# EAGLE design sdr_3157 (EAGLE 9.6.2)
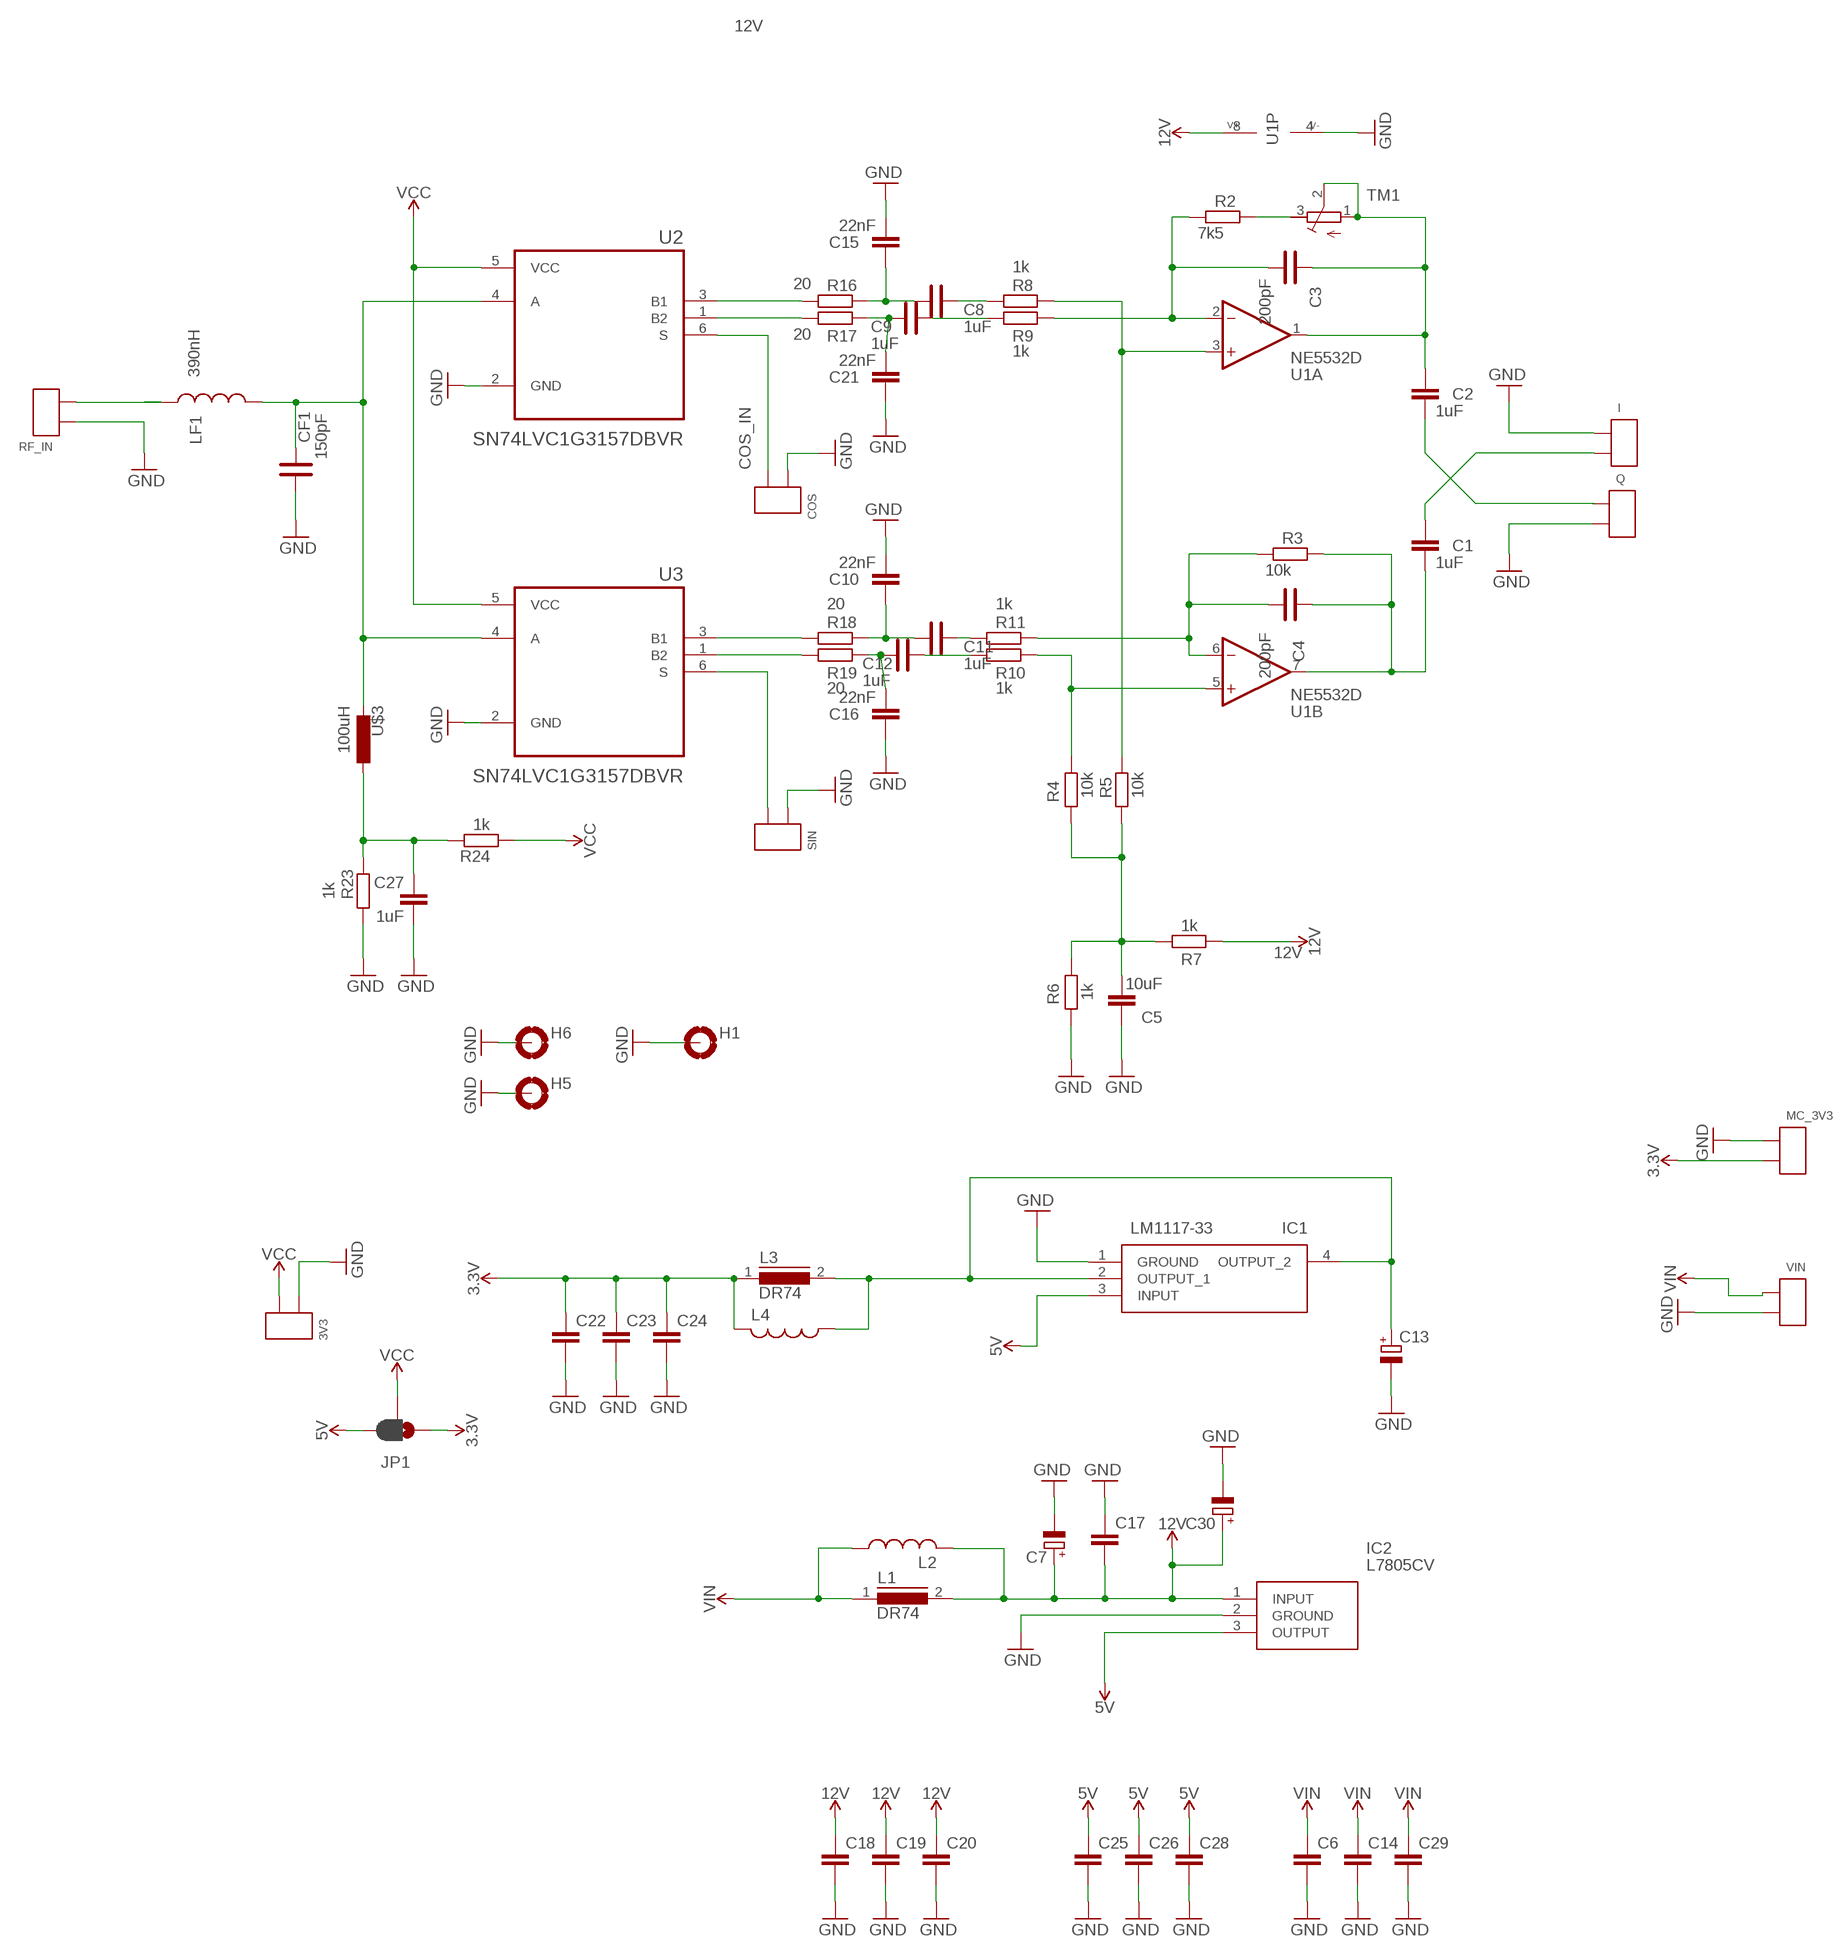
[diagram p0: schematic, sheet 1]

## Parts
3V3  2X_SMD_PTH_PIN  [2X_SMD_PTH]
C1  1uF  C-EU050-045X075  [C050-045X075]
C2  1uF  C-EU050-045X075  [C050-045X075]
C3  200pF  C_0805_PTH  [C0805K]
C4  200pF  C_0805_PTH  [C0805K]
C5  10uF  C_0805_SMD  [C0805]
C6  C_0805_SMD  [C0805]
C7  C_POL  [E5-5]
C8  1uF  C_0805_PTH  [C0805K]
C9  1uF  C_0805_PTH  [C0805K]
C10  22nF  C_0805_SMD  [C0805]
C11  1uF  C_0805_PTH  [C0805K]
C12  1uF  C_0805_PTH  [C0805K]
C13  C_POL  [E5-5]
C14  C_0805_SMD  [C0805]
C15  22nF  C_0805_SMD  [C0805]
C16  22nF  C_0805_SMD  [C0805]
C17  C_0805_SMD  [C0805]
C18  C_0805_SMD  [C0805]
C19  C_0805_SMD  [C0805]
C20  C_0805_SMD  [C0805]
C21  22nF  C_0805_SMD  [C0805]
C22  C_0805_SMD  [C0805]
C23  C_0805_SMD  [C0805]
C24  C_0805_SMD  [C0805]
C25  C_0805_SMD  [C0805]
C26  C_0805_SMD  [C0805]
C27  1uF  C_0805_SMD  [C0805]
C28  C_0805_SMD  [C0805]
C29  C_0805_SMD  [C0805]
C30  C_POL  [E5-5]
CF1  150pF  C_0805_PTH  [C0805K]
COS  2X_SMD_PTH_PIN  [2X_SMD_PTH]
H1  MOUNT-PAD-ROUND3.0  [3,0-PAD]
H5  MOUNT-PAD-ROUND3.0  [3,0-PAD]
H6  MOUNT-PAD-ROUND3.0  [3,0-PAD]
I  2X_SMD_PTH_PIN  [2X_SMD_PTH]
IC1  LM1117-33  LM1117MPX-33NOPB  [SOT230P700X180-4N]
IC2  L7805CV  [TO255P460X1020X2008-3P]
JP1  JUMPER-SMT_3_1-NC_PASTE_NO-SILK  [SMT-JUMPER_3_1-NC_PASTE_NO-SILK]
L1  DR74  [DR74]
L2  L_0805_PTH  [M0805]
L3  DR74  [DR74]
L4  L_0805_PTH  [M0805]
LF1  390nH  L_0805_PTH  [M0805]
MC_3V3  2X_SMD_PTH_PIN  [2X_SMD_PTH]
Q  2X_SMD_PTH_PIN  [2X_SMD_PTH]
R2  7k5  R_0805_SMD  [R0805W]
R3  10k  R_0805_SMD  [R0805W]
R4  10k  R_0805_SMD  [R0805W]
R5  10k  R_0805_SMD  [R0805W]
R6  1k  R_0805_SMD  [R0805W]
R7  1k  R_0805_SMD  [R0805W]
R8  1k  R_0805_SMD  [R0805W]
R9  1k  R_0805_SMD  [R0805W]
R10  1k  R_0805_SMD  [R0805W]
R11  1k  R_0805_SMD  [R0805W]
R16  20  R_0805_SMD  [R0805W]
R17  20  R_0805_SMD  [R0805W]
R18  20  R_0805_SMD  [R0805W]
R19  20  R_0805_SMD  [R0805W]
R23  1k  R_0805_SMD  [R0805W]
R24  1k  R_0805_SMD  [R0805W]
RF_IN  2X_SMD_PTH_PIN  [2X_SMD_PTH]
SIN  2X_SMD_PTH_PIN  [2X_SMD_PTH]
TM1  5k  R-TRIMM3296W  [RTRIM3296W]
U1  NE5532D  [SO08]
U2  SN74LVC1G3157DBVR  [SOT95P280X145-6N]
U3  SN74LVC1G3157DBVR  [SOT95P280X145-6N]
U$3  100uH  L-EU0207/10  [0207/10]
VIN  2X_SMD_PTH_PIN  [2X_SMD_PTH]

## Nets
3.3V: C22.1 C23.1 C24.1 JP1.1 L3.1 L4.2 L4.P$2 MC_3V3.P$2(PIN1) MC_3V3.T$2(PIN1)
5V: C25.1 C26.1 C28.1 IC1.3(INPUT) IC2.3(OUTPUT) JP1.3
12V: C7.+ C17.2 C18.1 C19.1 C20.1 C30.+ IC2.1(INPUT) L1.2 L2.2 L2.P$2 R7.1 U1.8(P:V+)
ANTENNA: CF1.2 CF1.P$2 LF1.2 LF1.P$2 U2.4(A) U3.4(A) U$3.2
COS_IN: COS.P$2(PIN1) COS.T$2(PIN1) U2.6(S)
GND: 3V3.P$1(PIN0) 3V3.T$1(PIN0) C5.1 C6.2 C7.- C10.2 C13.- C14.2 C15.2 C16.1 C17.1 C18.2 C19.2 C20.2 C21.1 C22.2 C23.2 C24.2 C25.2 C26.2 C27.1 C28.2 C29.2 C30.- CF1.1 CF1.P$1 COS.P$1(PIN0) COS.T$1(PIN0) H1.B3,0(MOUNT) H5.B3,0(MOUNT) H6.B3,0(MOUNT) I.P$1(PIN0) I.T$1(PIN0) IC1.1(GROUND) IC2.2(GROUND) MC_3V3.P$1(PIN0) MC_3V3.T$1(PIN0) Q.P$2(PIN1) Q.T$2(PIN1) R6.1 R23.1 RF_IN.P$1(PIN0) RF_IN.T$1(PIN0) SIN.P$1(PIN0) SIN.T$1(PIN0) U1.4(P:V-) U2.2(GND) U3.2(GND) VIN.P$2(PIN1) VIN.T$2(PIN1)
N$1: LF1.1 LF1.P$1 RF_IN.P$2(PIN1) RF_IN.T$2(PIN1)
N$3: R16.1 U2.3(B1)
N$4: R17.1 U2.1(B2)
N$5: R18.1 U3.3(B1)
N$6: C13.+ IC1.2(OUTPUT_1) IC1.4(OUTPUT_2) L3.2 L4.1 L4.P$1
N$7: R19.1 U3.1(B2)
N$8: C8.1 C8.P$1 C15.1 R16.2
N$9: C9.1 C9.P$1 C21.2 R17.2
N$10: C10.1 C11.1 C11.P$1 R18.2
N$11: C12.1 C12.P$1 C16.2 R19.2
N$12: C8.2 C8.P$2 R8.1
N$13: C9.2 C9.P$2 R9.1
N$14: C11.2 C11.P$2 R11.1
N$15: C12.2 C12.P$2 R10.1
N$16: R5.2 R8.2 U1.3(A:+IN)
N$17: C3.1 C3.P$1 R2.1 R9.2 U1.2(A:-IN)
N$18: R4.2 R10.2 U1.5(B:+IN)
N$19: C4.1 C4.P$1 R3.1 R11.2 U1.6(B:-IN)
N$20: C5.2 R4.1 R5.1 R6.2 R7.2
N$21: C2.1 C3.2 C3.P$2 TM1.1(A) TM1.2(S) U1.1(A:OUT)
N$22: C2.2 Q.P$1(PIN0) Q.T$1(PIN0)
N$23: C1.1 I.P$2(PIN1) I.T$2(PIN1)
N$24: C1.2 C4.2 C4.P$2 R3.2 U1.7(B:OUT)
N$25: C27.2 R23.2 R24.2 U$3.1
N$28: R2.2 TM1.3(E)
SIN_IN: SIN.P$2(PIN1) SIN.T$2(PIN1) U3.6(S)
VCC: 3V3.P$2(PIN1) 3V3.T$2(PIN1) JP1.2 R24.1 U2.5(VCC) U3.5(VCC)
VIN: C6.1 C14.1 C29.1 L1.1 L2.1 L2.P$1 VIN.P$1(PIN0) VIN.T$1(PIN0)

## Library data of the parts
3V3 COS I MC_3V3 Q RF_IN SIN VIN = mylib:2X_SMD_PTH_PIN
C1 C2 = rcl:C-EU: CAPACITOR, European symbol; SPICEPREFIX: C
C3 C4 C8 C9 C11 C12 CF1 = mylib:C_0805_PTH
C5 C6 C10 C14-C29 = mylib:C_0805_SMD
C7 C13 C30 = mylib:C_POL
H1 H5 H6 = holes:MOUNT-PAD-ROUND: MOUNTING PAD, round
IC1 = LM1117MPX-33NOPB:LM1117MPX-33NOPB: LDO Voltage Regulators 800-mA 15-V linear voltage regulator 800-mA 15-V linear voltage regulator Source: Datasheet <https://www.arrow.com/en/products/lm1117mpx-33nopb/on-semiconductor>; ARROW_PART_NUMBER: LM1117MPX-33NOPB; ARROW_PRICE-STOCK: https://www.arrow.com/en/products/lm1117mpx-33nopb/on-semiconductor?region=nac; DESCRIPTION: LDO Voltage Regulators 800-mA 15-V linear voltage regulator 800-mA 15-V linear voltage regulator; HEIGHT: 1.8mm; MANUFACTURER_NAME: onsemi; MANUFACTURER_PART_NUMBER: LM1117MPX-33NOPB; MOUSER_PART_NUMBER: 863-LM1117MPX-33NOPB; MOUSER_PRICE-STOCK: https://www.mouser.co.uk/ProductDetail/onsemi/LM1117MPX-33NOPB?qs=DPoM0jnrROUIbzbQHFmeig%3D%3D
IC2 = L7805CV:L7805CV: Linear voltage regulator,L7805CV 5V 1.5A STMicroelectronics L7805CV, Single Linear Voltage Regulator, 1.5A 5 V, 3-Pin TO-220 Source: Datasheet <http://www.st.com/web/en/resource/technical/document/datasheet/CD00000444.pdf>; ARROW_PART_NUMBER: L7805CV; ARROW_PRICE-STOCK: https://www.arrow.com/en/products/l7805cv/stmicroelectronics?region=europe; DESCRIPTION: Linear voltage regulator,L7805CV 5V 1.5A STMicroelectronics L7805CV, Single Linear Voltage Regulator, 1.5A 5 V, 3-Pin TO-220; HEIGHT: 4.6mm; MANUFACTURER_NAME: STMicroelectronics; MANUFACTURER_PART_NUMBER: L7805CV; MOUSER_PART_NUMBER: 511-L7805CV; MOUSER_PRICE-STOCK: https://www.mouser.co.uk/ProductDetail/STMicroelectronics/L7805CV?qs=9NrABl3fj%2FqplZAHiYUxWg%3D%3D
JP1 = SparkFun-Jumpers:JUMPER-SMT_3_1-NC_PASTE: Normally closed solder jumper (1 of 2 connections) This jumper has an aperture in the stencil to allow solder paste to bridge one of the two connections. One connection is normally closed (NC), while the other is normally open (NO). Wick off the solder to open the connection. Reapply solder to reclose the connection. Apply solder to the other side instead to change the current path.
L1 L3 = inductors:DR74: High Power Density, High Efficiency, Shielded Inductors Source: coiltronics_dr_series.pdf; SPICEPREFIX: L
L2 L4 LF1 = mylib:L_0805_PTH
R2-R11 R16-R19 R23 R24 = mylib:R_0805_SMD
TM1 = rcl:R-TRIMM: Trimm resistor; SPICEMODEL: X; SPICEPREFIXL: POT
U1 = op-amp:NE5532: OP-AMP
U2 U3 = SN74LVC1G3157DBVR:SN74LVC1G3157DBVR: Check prices <https://pricing.snapeda.com/parts/SN74LVC1G3157DBVR/Texas%20Instruments/view-part?ref=eda>; AVAILABILITY: In Stock; DESCRIPTION: 5-V, 2:1 (SPDT), 1-channel general-purpose analog switch 6-SOT-23 -40 to 125; MF: Texas Instruments; MP: SN74LVC1G3157DBVR; PACKAGE: SOT-23-6 Texas Instruments; PRICE: None; PURCHASE-URL: https://pricing.snapeda.com/search/part/SN74LVC1G3157DBVR/?ref=eda
U$3 = rcl:L-EU: INDUCTOR, European symbol; SPICEPREFIX: L

## Board
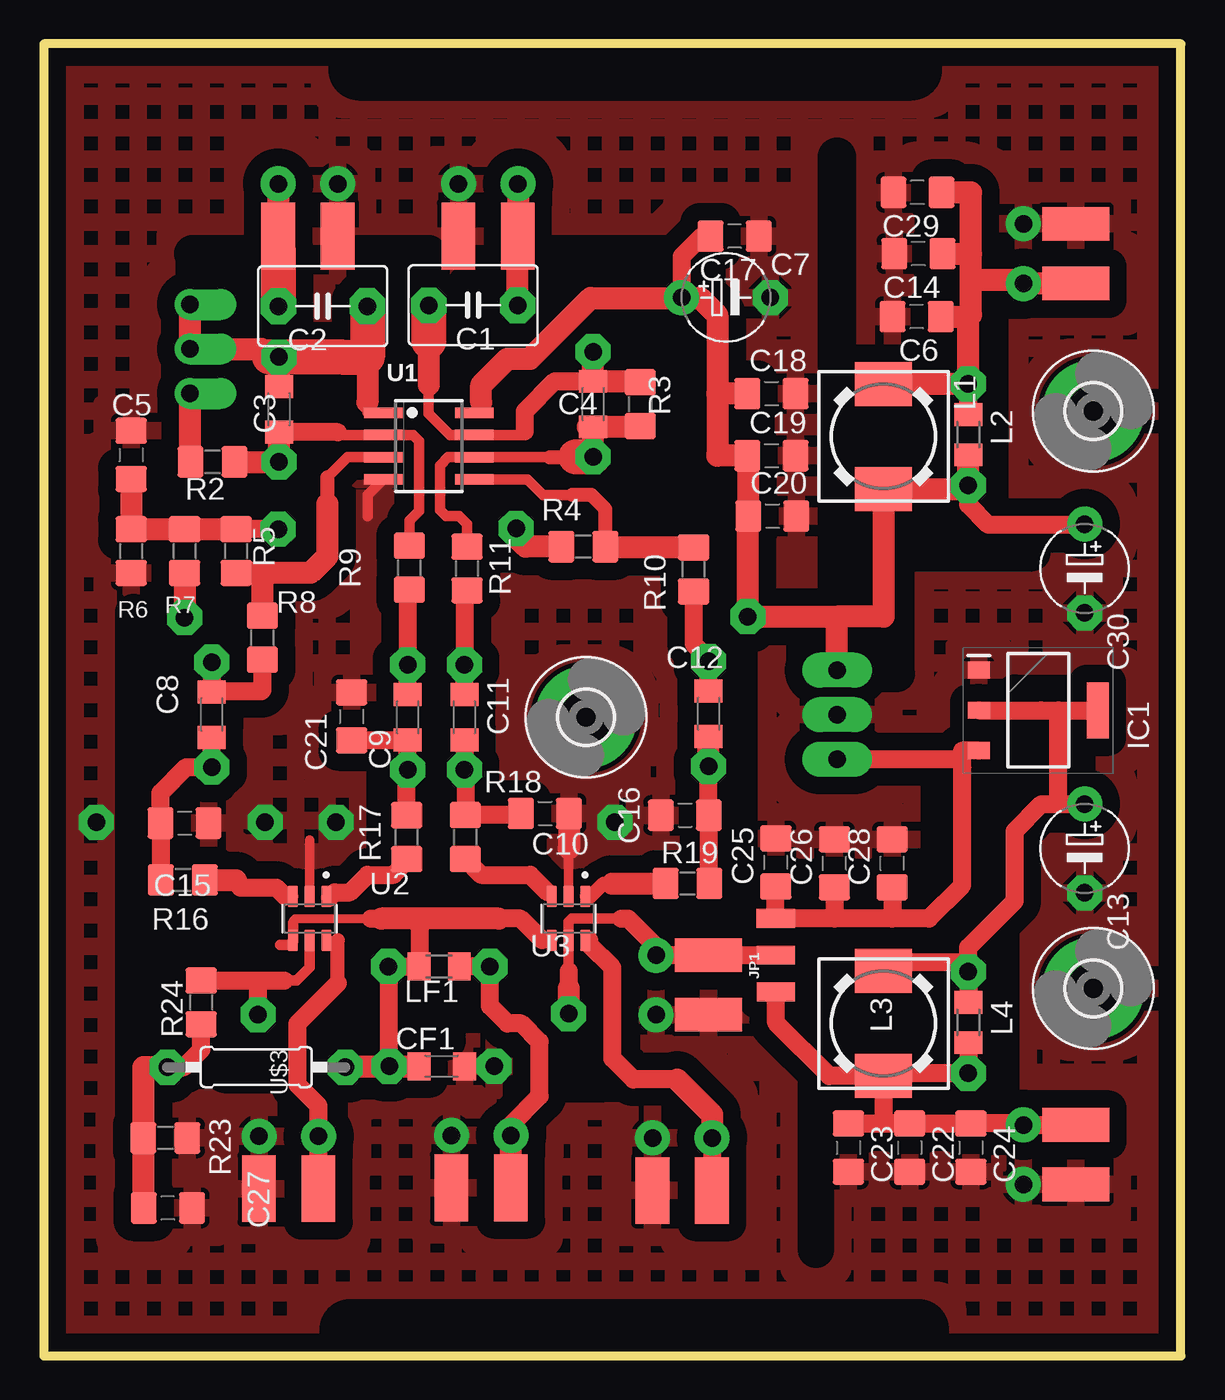
[diagram p1: board, top side]
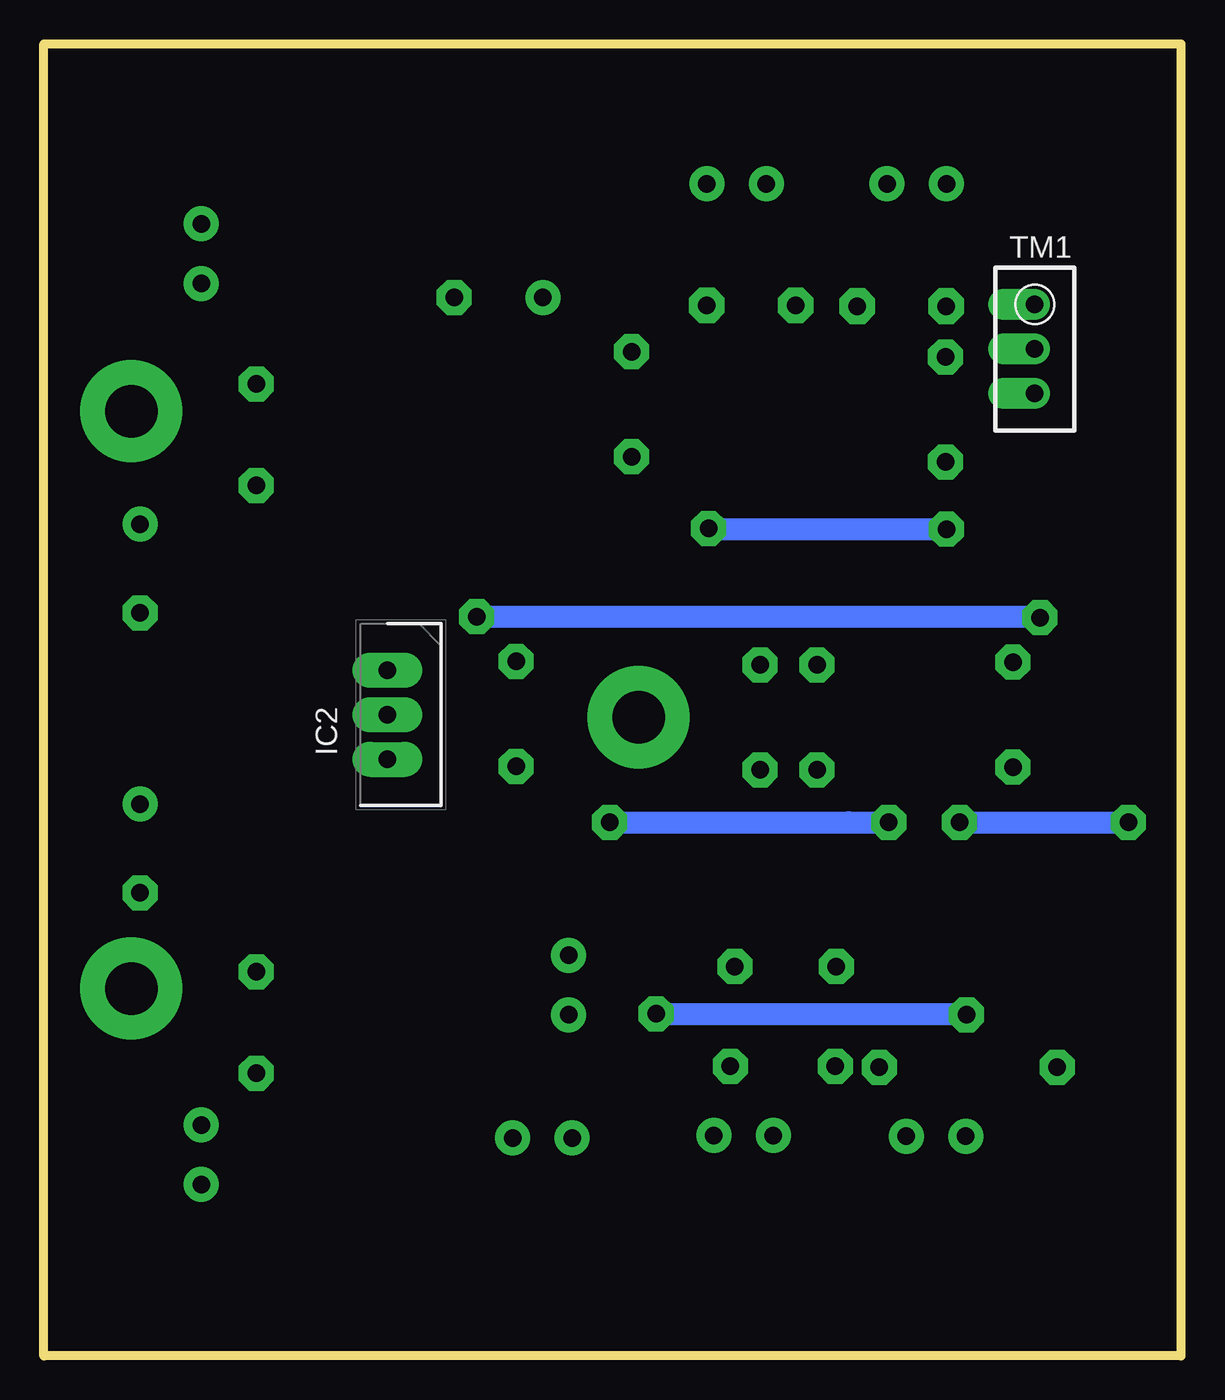
[diagram p2: board, bottom side, seen from below]

Size 65 x 75 mm. Coordinates in mm from the lower left corner, seen from the top.
Outline: 0,0 65,0 65,75 0,75 0,0
Copper layers (1*16): Top 0.035mm / dielectric 1.5mm / Bottom 0.035mm
Design rules "default": minimum track width 6mil, minimum drill 0.35mm, track to track 6mil, track to pad 6mil, pad to pad 6mil, via to via 6mil, smd to smd 6mil, copper to edge 40mil, drill to drill 6mil, minimum pad ring 10mil, minimum via ring 8mil, stop-mask expansion 4mil, vias tented up to drill 0mil, thermal gap 10mil
tRestrict: 58 lines

### Footprints (pad centres in the part's own frame; a part is rotated, then mirrored left to right if it is on the bottom)
2X_SMD_PTH = smd 3.81 x 1.93: P$1 0,1.7; P$2 0,-1.7 | drill 1 pad 2: T$1 3,1.7; T$2 3,-1.7
C050-045X075 = drill 1 pad 2.032 octagon: 1 -2.54,0; 2 2.54,0
C0805K = smd 1.3 x 1.6: 1 -1.3,0; 2 1.3,0 | drill 1 pad 2 octagon: P$1 -3,0; P$2 3,0
C0805 = smd 1.5 x 1.8: 1 -1.377,0; 2 1.377,0
E5-5 = drill 1 pad 2: + -2.54,0 | drill 1 pad 2 octagon: - 2.54,0
3,0-PAD = drill 3 pad 5.842: B3,0 0,0
SOT230P700X180-4N = smd 1.25 x 0.95: 1 -3.4,2.3; 2 -3.4,0; 3 -3.4,-2.3 | smd 1.25 x 3.2: 4 3.4,0
TO255P460X1020X2008-3P = drill 1 pad 2 long: 1 0,0; 2 2.55,0; 3 5.1,0
SMT-JUMPER_3_1-NC_PASTE_NO-SILK = smd 1.067 x 2.184: 1 -1.5,0.187; 2 0.6,0.2; 3 2.7,0.213
DR74 = smd 2.5 x 3.25: 1 -3,0; 2 3,0
M0805 = smd 1.3 x 1.6: 1 -1.15,0; 2 1.15,0 | drill 1 pad 2 octagon: P$1 -2.9,0; P$2 2.9,0
R0805W = smd 1.5 x 1.8: 1 -1.252,0; 2 1.252,0
RTRIM3296W = drill 1 pad 1.778 offset: 1 0,-2.54; 2 0,0; 3 0,2.54
SO08 = smd 0.6 x 2.2: 1 -1.905,-2.6; 2 -0.635,-2.6; 3 0.635,-2.6; 4 1.905,-2.6; 5 1.905,2.6; 6 0.635,2.6; 7 -0.635,2.6; 8 -1.905,2.6
SOT95P280X145-6N = smd 1.21 x 0.58: 1 -1.255,0.95; 2 -1.255,0; 3 -1.255,-0.95; 4 1.255,-0.95; 5 1.255,0; 6 1.255,0.95
0207/10 = drill 1 pad 2 octagon: 1 -5.08,0; 2 5.08,0

### Placement (x,y rotation side)
3V3  38,21.2 180 top
C1  24.55,60.05 180 top
C2  15.95,60 180 top
C3  13.45,54.1 90 top
C4  31.4,54.4 90 top
C5  5,51.5 270 top
C6  49.9,59.4 180 top
C7  39,60.5 0 top
C8  9.6,36.65 90 top
C9  20.8,36.5 90 top
C10  28.65,31 0 top
C11  24.05,36.5 90 top
C12  38,36.7 90 top
C13  59.5,29 270 top
C14  50,63 180 top
C15  8.05,30.45 0 top
C16  36.65,30.9 0 top
C17  39.5,64 180 top
C18  41.6,55 0 top
C19  41.6,51.45 0 top
C20  41.65,48 0 top
C21  17.6,36.55 270 top
C22  49.5,11.9 270 top
C23  46,11.9 270 top
C24  53,11.9 270 top
C25  41.85,28.2 90 top
C26  45.2,28.15 90 top
C27  7.1,8.45 180 top
C28  48.5,28.15 90 top
C29  49.95,66.5 180 top
C30  59.5,45 270 top
CF1  22.75,16.55 180 top
COS  14,9.55 90 top
H1  31,36.5 0 top
H5  60,21 0 top
H6  60,54 0 top
I  25.4,64 90 top
IC1  56.85,36.9 0 top
IC2  45.35,39.2 270 bottom
JP1  42.05,22.3 90 top
L1  48,52.55 270 top
L2  52.85,52.65 270 top
L3  48,19 90 top
L4  52.85,19.05 270 top
LF1  22.6,22.25 180 top
MC_3V3  59,11.5 180 top
Q  15.1,64 90 top
R2  9.65,51.1 180 top
R3  34.1,54.4 90 top
R4  30.85,46.25 0 top
R5  11,46 270 top
R6  5,46 90 top
R7  8.05,46 90 top
R8  12.5,41.05 90 top
R9  20.9,45.05 90 top
R10  37.15,44.95 90 top
R11  24.2,45 90 top
R16  7.95,27.2 180 top
R17  20.75,29.65 90 top
R18  24.1,29.65 90 top
R19  36.8,27 0 top
R23  6.95,12.45 180 top
R24  9,20.2 270 top
RF_IN  25,9.6 90 top
SIN  36.5,9.45 90 top
TM1  8.35,57.55 180 bottom
U1  22,52 270 top
U2  15.2,25 270 top
U3  30,25 270 top
U$3  12.15,16.5 0 top
VIN  59,63 180 top

### Tracks (layer width: path | path; a pad name or v marks a point on that pad's centre or on a via)
3.3V
  Top 1.016: L4.2 L4.P$2 48.15,16.15 L3.1 | C22.1 48.12,13.28 48,13.4 L3.1 | C23.1 C22.1 | C22.1 C24.1 56,13.28 MC_3V3.T$2 MC_3V3.P$2 | L3.1 44.9,16 41.86,19.04 JP1.1
5V
  Top 1.016: C26.1 45.2,25.1 45.2,25 | 45.2,25 JP1.3 41.84,26.82 C25.1 | 52.5,34.1 IC2.3 | 52.5,33.6 52.5,26.9 50.6,25 48.5,25 | 52.5,33.6 52.5,34.1 | 52.5,34.1 52.5,34.6 IC1.3 | 52.5,33.65 52.5,33.6 | 48.5,25 45.2,25 | C28.1 48.5,25
12V  (via drill 1 pad 2)
  Top 0.61: U1.8 25,53.91 25,54.5
  Top 1.016: 47.85,49.4 L1.2 47.85,49.35 | 36.46,60.46 C7.+ 36.46,62.84 37.62,64 C17.2 | C30.+ 59.46,47.5 54,47.5 52.85,48.65 L2.P$2
  Top 1.27: 25,54.5 25,55.5 26.5,57 27.8,57 31.26,60.46 36.46,60.46 37.46,60.46 37.54,60.46 38.5,59.5 38.5,55 | R7.1 v8.05,42.2 | 38.5,55 38.5,51.5 38.5,51.45 C19.1 40.27,51.4 C20.1 40.25,47.98 v40.25,42.25 45.35,42.25 | C18.1 38.5,55 | IC2.1 45.35,42.25 | 47.85,49.35 47.85,49.4 | L2.2 L2.P$2 52.65,49.55 L1.2 48,42.25 45.35,42.25
  Bottom 1.27: v40.25,42.25 8.1,42.25 v8.05,42.2
ANTENNA
  Top 0.508: 14.25,24.75 arc-90 14.5,25 18.7,25
  Top 0.61: U3.4 28.5,23.75 | 14.25,24.75 U2.4 arc-90 14.01,23.5 13.5,23.5
  Top 1.016: 21.1,25 21.5,25 21.5,22.3 LF1.2 LF1.P$2 19.75,22.2 CF1.P$2 | 18.7,25 19.3,25 | 28.5,23.75 27.25,25 26,25
  Top 1.27: 26,25 21.5,25 21.1,25 19.3,25 | U$3.2 17.28,16.55 CF1.P$2 CF1.2
COS_IN
  Top 0.508: U2.6 16.8,23.75
  Top 0.813: 16.8,21.3 16.8,23.75
  Top 1.016: 16.8,21.3 14.5,19 14.5,15.5 15.7,14.3 COS.T$2 COS.P$2
GND  (via drill 1 pad 2)
  Top 0.55: U3.2 30,27 30,29 30,29.37 | U2.2 15.2,29.5
  Top 0.61: U1.4 18.5,49.2 18.5,48
  Top 1.27: C10.2 30.03,29 30,29
  Bottom 1.27: v12.65,30.5 v3,30.5 | v32.65,30.5 19,30.5 v16.7,30.5
  pour Top (isolate 1, hatched): -2.29,77.72 -2.29,-2.92 67.22,-2.92 67.22,77.72
N$1
  Top 1.016: LF1.1 LF1.P$1 25.5,20 26.5,19 27.3,19 28.35,17.95 28.35,14.85 26.7,13.2 RF_IN.T$2
  Top 1.27: RF_IN.P$2 RF_IN.T$2
N$3
  Top 0.5: U2.3
  Top 0.61: 13.8,26.25 U2.3
  Top 1.016: 10.99,27.2 11.25,26.75 13.3,26.75 13.8,26.25
  Top 1.27: R16.1 10.99,27.2
N$4
  Top 0.55: 16.28,26.13 U2.1
  Top 0.61: 16.28,26.13 16.35,26.2
  Top 1.016: 16.35,26.2 16.65,26.5 17.5,26.5 18.5,27.5 20,27.5 20.75,28.25 R17.1
N$5
  Top 0.55: U3.3 29,26.25
  Top 0.61: 29,26.25 29,26.5 28.8,26.5
  Top 1.016: R18.1 25,27.5 27.8,27.5 28.8,26.5
N$6
  Top 1.016: L4.P$1 L4.1 | L3.2 48.5,22.5 52.3,22.5 L4.P$1 | IC1.2 57,36.9 58,36.9 | 58,36.9 IC1.4 | L4.P$1 52.85,23.35 55.5,26 55.5,28 55.5,28.5 55.5,30 57.04,31.54 58,31.54 | 58,31.54 C13.+ | 58,31.54 58,36.9
N$7
  Top 0.61: U3.1 31.25,26.25
  Top 0.813: 31.25,26.25 32,27 32.5,27
  Top 1.27: 32.5,27 R19.1
N$8
  Top 1.016: C8.1 C8.P$1 8.15,33.65 6.67,32.17 C15.1 6.67,27.22 R16.2
N$9
  Top 1.016: C21.2 20.77,35.17 C9.1 C9.P$1 20.75,33.45 R17.2
N$10
  Top 1.016: C11.1 C11.P$1 24.1,33.45 R18.2 27.18,30.9 C10.1
N$11
  Top 1.016: R19.2 38.03,27.03 C16.2 38,30.93 C12.P$1
  Top 1.27: C12.P$1 C12.1
N$12
  Top 1.016: C8.P$2 C8.2 9.65,38 12.45,38 12.5,38.05 R8.1
N$13
  Top 1.016: C9.2 C9.P$2 20.8,43.7 R9.1
N$14
  Top 1.016: C11.2 C11.P$2 24.05,43.6 R11.1
N$15
  Top 1.016: C12.2 C12.P$2 38,39.85 37.15,40.7 R10.1
N$16
  Top 0.61: 16.2,50.2 17.36,51.37 U1.3
  Top 0.813: 16.2,50.2 16.2,48.7
  Top 1.27: 16.2,48.7 16.2,45.7 15.25,44.75 12.5,44.75 | 12.5,44.75 R5.2 | R8.2 12.5,44.75
N$17
  Top 0.61: R9.2 20.9,47.75 21.45,48.3 21.45,52.3 21.11,52.63 U1.2 16.96,52.63 16.8,52.8
  Top 1.016: 16.8,52.8 C3.1
  Top 1.27: C3.1 C3.P$1 R2.1
N$18
  Top 0.61: U1.5 25.6,50.09 27.66,50.09 28.55,49.2 30.2,49.2
  Top 0.813: R4.2 32.1,48.4 31.3,49.2 30.2,49.2
  Top 1.27: R4.2 32.15,46.2 R10.2
N$19
  Top 0.61: 28.93,51.37 25.5,51.37 | 25.5,51.37 U1.6 | R11.2 24.2,47.55 23.75,48 23,48 22.65,48.35 22.65,50.9 23.11,51.37 25.5,51.37
  Top 0.813: 28.93,51.37 30.36,51.37
  Top 1.016: 31.1,53.1 C4.1 | R3.1 34.05,53.1
  Top 1.27: C4.P$1 C4.1 | 34.05,53.1 31.1,53.1 | 30.4,51.4 30.36,51.37
  Top 2: 30.4,51.4 C4.P$1
N$20  (via drill 1 pad 2)
  Top 1.016: R5.1 v13.4,47.25
  Top 1.27: R5.1 11.05,47.3 R5.1 | C5.2 R6.2 R7.2 R5.1 | R4.1 27.55,46.25 27,46.8 v27,47.3
  Bottom 1.27: v27,47.3 26.95,47.25 v13.4,47.25
N$21
  Top 0.61: U1.1 18.5,53.91 18.5,54.5
  Top 1.27: TM1.1 TM1.2 12.45,57.55 12.9,57.1 | C3.2 C3.P$2 | 18.5,57.1 18.5,54.5
  Top 2: C2.1 18.5,57.1 17,57.1 C3.P$2 12.9,57.1
N$22
  Top 1.27: Q.P$1 13.41,63.19 Q.P$1 | Q.T$1 Q.P$1
  Top 2: 13.41,63.19 C2.2
N$23
  Top 1.27: I.T$2 I.P$2 C1.1
N$24
  Top 0.61: 27.5,52.85 27.29,52.63 U1.7 23.21,52.63 22,53.85 22,55.5
  Top 1.016: C4.2 29.2,55.7 27.5,54 27.5,52.85 | 34.05,55.7 R3.2
  Top 1.27: C4.P$2 C4.2 34.05,55.7 | C1.2 | 22,58 22,55.5
  Top 2: C1.2 22,58
N$25
  Top 1.016: U$3.1 8,16.5 9,17.5 R24.2
  Top 1.27: U$3.1 5.7,16.5 R23.2 5.72,12.45 C27.2
N$28
  Top 1.27: TM1.3 8.35,54.51 8.35,51.15 R2.2
SIN_IN
  Top 0.55: 31.2,23.75 U3.6
  Top 1.016: SIN.T$2 SIN.P$2 | 36.2,15.8 33.7,15.8 32.5,17 32.5,22.2 31.2,23.5 31.2,23.75
  Top 1.27: SIN.T$2 38.2,13.8 36.2,15.8
VCC  (via drill 1 pad 2)
  Top 0.61: 33,25 30.2,25 30,24.8 U3.5 30,22 | 13.75,21.45 14.45,21.45 15.2,22.2 U2.5
  Top 1.016: JP1.2 3V3.P$2 3V3.T$2 35,23.4 33.4,25 33,25 | R24.1 12.25,21.45 | 12.25,21.45 13.75,21.45 | v12.25,19.5 12.25,21.45 | 30,22 30,21
  Top 1.27: 30,21 v30,19.55
  Bottom 1.27: v30,19.55 12.3,19.55 v12.25,19.5
VIN
  Top 1.016: L2.1 L2.P$1 | C6.1 52.9,59.4
  Top 1.27: VIN.P$1 VIN.T$1 55.8,61.5 53,61.5 | 53,61.5 53,59.5 52.9,59.4 | 53,61.5 53,63 | 53,63 53,66.5 C29.1 | C14.1 53,63 | C6.1 52.85,59.4 L2.P$1 L1.1